# EAGLE schematic Arm_Board_2018 (EAGLE 8.2.2)

## Sheet 1 of 4: Tiva C + Misc
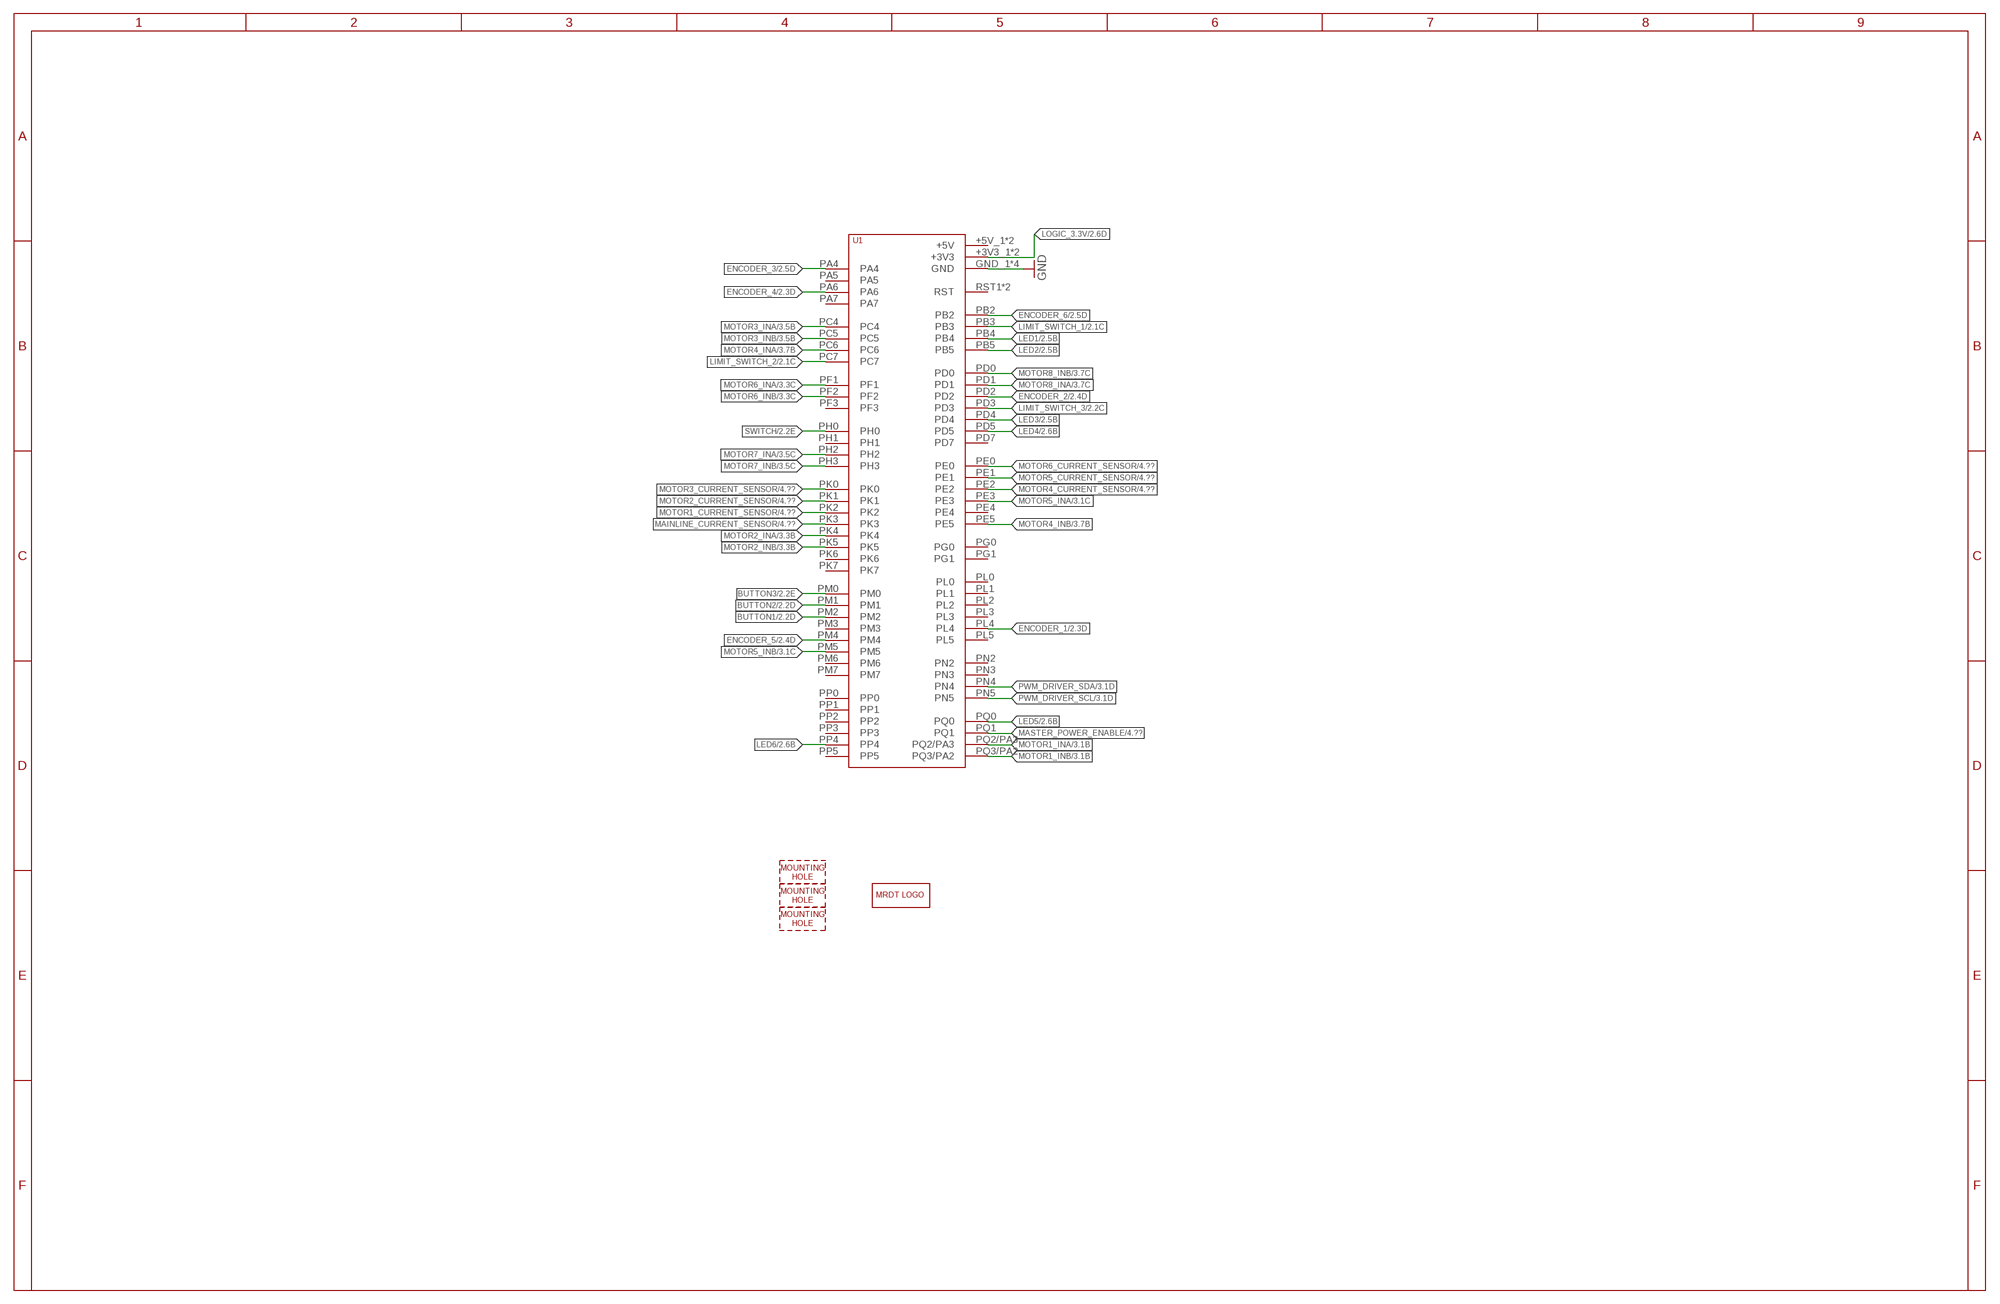
[diagram p0: schematic, sheet 1]

### Parts
H1  MOUNTING_HOLE#6  [#6_SCREW]
H2  MOUNTING_HOLE#6  [#6_SCREW]
H3  MOUNTING_HOLE#6  [#6_SCREW]
LOGO1  MRDT_LOGO  [MRDT_LOGO]
U1  TIVA-1294  [TIVA-C-CONNECTED]

### Nets
BUTTON1: U1.PM2 ; also sheet 2
BUTTON2: U1.PM1 ; also sheet 2
BUTTON3: U1.PM0 ; also sheet 2
ENCODER_1: U1.PL4 ; also sheet 2
ENCODER_2: U1.PD2 ; also sheet 2
ENCODER_3: U1.PA4 ; also sheet 2
ENCODER_4: U1.PA6 ; also sheet 2
ENCODER_5: U1.PM4 ; also sheet 2
ENCODER_6: U1.PB2 ; also sheet 2
GND: U1.GND_1(GND) U1.GND_2(GND) U1.GND_3(GND) U1.GND_4(GND) ; also sheet 2,3,4
LED1: U1.PB4 ; also sheet 2
LED2: U1.PB5 ; also sheet 2
LED3: U1.PD4 ; also sheet 2
LED4: U1.PD5 ; also sheet 2
LED5: U1.PQ0 ; also sheet 2
LED6: U1.PP4 ; also sheet 2
LIMIT_SWITCH_1: U1.PB3 ; also sheet 2
LIMIT_SWITCH_2: U1.PC7 ; also sheet 2
LIMIT_SWITCH_3: U1.PD3 ; also sheet 2
LOGIC_3.3V: U1.+3V3_1(+3V3) U1.+3V3_2(+3V3) ; also sheet 2,3,4
MAINLINE_CURRENT_SENSOR: U1.PK3 ; also sheet 4
MASTER_POWER_ENABLE: U1.PQ1 ; also sheet 4
MOTOR1_CURRENT_SENSOR: U1.PK2 ; also sheet 4
MOTOR1_INA: U1.PQ2/PA3 ; also sheet 3
MOTOR1_INB: U1.PQ3/PA2 ; also sheet 3
MOTOR2_CURRENT_SENSOR: U1.PK1 ; also sheet 4
MOTOR2_INA: U1.PK4 ; also sheet 3
MOTOR2_INB: U1.PK5 ; also sheet 3
MOTOR3_CURRENT_SENSOR: U1.PK0 ; also sheet 4
MOTOR3_INA: U1.PC4 ; also sheet 3
MOTOR3_INB: U1.PC5 ; also sheet 3
MOTOR4_CURRENT_SENSOR: U1.PE2 ; also sheet 4
MOTOR4_INA: U1.PC6 ; also sheet 3
MOTOR4_INB: U1.PE5 ; also sheet 3
MOTOR5_CURRENT_SENSOR: U1.PE1 ; also sheet 4
MOTOR5_INA: U1.PE3 ; also sheet 3
MOTOR5_INB: U1.PM5 ; also sheet 3
MOTOR6_CURRENT_SENSOR: U1.PE0 ; also sheet 4
MOTOR6_INA: U1.PF1 ; also sheet 3
MOTOR6_INB: U1.PF2 ; also sheet 3
MOTOR7_INA: U1.PH2 ; also sheet 3
MOTOR7_INB: U1.PH3 ; also sheet 3
MOTOR8_INA: U1.PD1 ; also sheet 3
MOTOR8_INB: U1.PD0 ; also sheet 3
PWM_DRIVER_SCL: U1.PN5 ; also sheet 3
PWM_DRIVER_SDA: U1.PN4 ; also sheet 3
SWITCH: U1.PH0 ; also sheet 2
Unconnected: U1.+5V_1(+5V) U1.+5V_2(+5V) U1.PA5 U1.PA7 U1.PD7 U1.PE4 U1.PF3 U1.PG0 U1.PG1 U1.PH1 U1.PK6 U1.PK7 U1.PL0 U1.PL1 U1.PL2 U1.PL3 U1.PL5 U1.PM3 U1.PM6 U1.PM7 U1.PN2 U1.PN3 U1.PP0 U1.PP1 U1.PP2 U1.PP3 U1.PP5 U1.RST1(RST) U1.RST_2(RST)

## Sheet 2 of 4: I/O
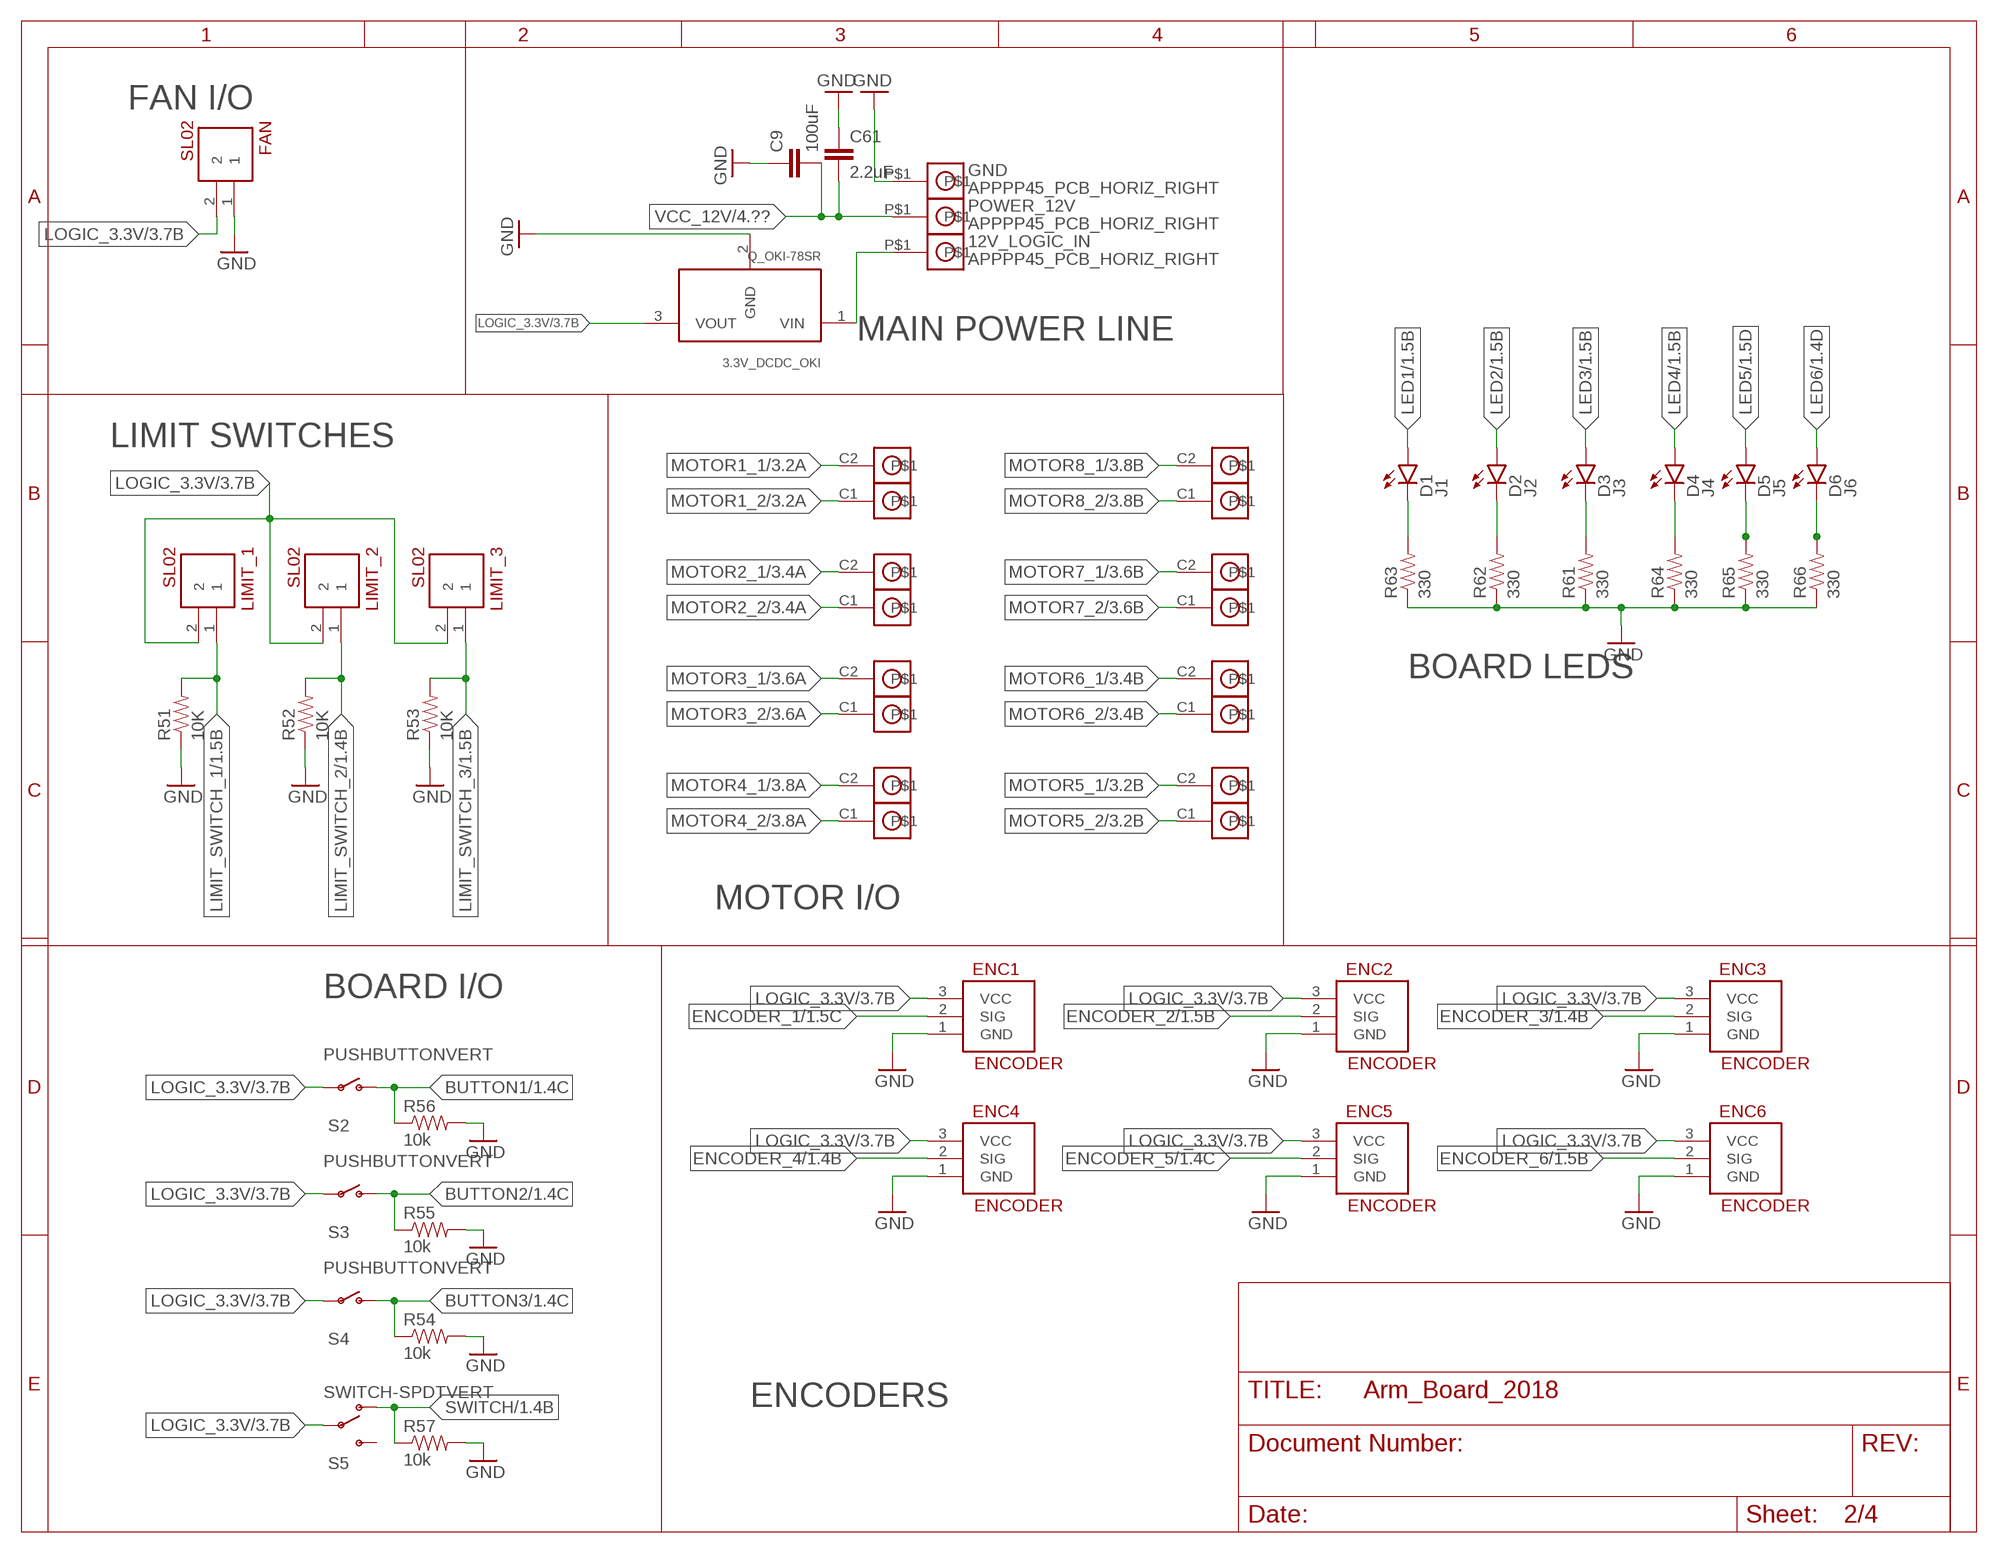
[diagram p1: schematic, sheet 2]

### Parts
3.3V_DCDC_OKI  Q_OKI-78SR  [Q_OKI-78SR]
12V_LOGIC_IN  APPPP45_PCB_HORIZ_RIGHT  [APP45_PCB_HORIZ_RIGHT]
C9  100uF  CAP1210  [1210]
C61  2.2uF  CAP1206  [1206]
D1  J1  LED0603  [LED-0603]
D2  J2  LED0603  [LED-0603]
D3  J3  LED0603  [LED-0603]
D4  J4  LED0603  [LED-0603]
D5  J5  LED0603  [LED-0603]
D6  J6  LED0603  [LED-0603]
ENC1  ENCODER  [MOLEX-70543-0002]
ENC2  ENCODER  [MOLEX-70543-0002]
ENC3  ENCODER  [MOLEX-70543-0002]
ENC4  ENCODER  [MOLEX-70543-0002]
ENC5  ENCODER  [MOLEX-70543-0002]
ENC6  ENCODER  [MOLEX-70543-0002]
FAN  SL02  [MOLEX-70543-0001]
GND  APPPP45_PCB_HORIZ_RIGHT  [APP45_PCB_HORIZ_RIGHT]
LIMIT_1  SL02  [MOLEX-70543-0001]
LIMIT_2  SL02  [MOLEX-70543-0001]
LIMIT_3  SL02  [MOLEX-70543-0001]
MOTOR1  APP_2POS_CONFIGGENERAL_CONFIG  [APP45_HORIZ_CONFIG]
MOTOR2  APP_2POS_CONFIGGENERAL_CONFIG  [APP45_HORIZ_CONFIG]
MOTOR3  APP_2POS_CONFIGGENERAL_CONFIG  [APP45_HORIZ_CONFIG]
MOTOR4  APP_2POS_CONFIGGENERAL_CONFIG  [APP45_HORIZ_CONFIG]
MOTOR5  APP_2POS_CONFIGGENERAL_CONFIG  [APP45_HORIZ_CONFIG]
MOTOR6  APP_2POS_CONFIGGENERAL_CONFIG  [APP45_HORIZ_CONFIG]
MOTOR7  APP_2POS_CONFIGGENERAL_CONFIG  [APP45_HORIZ_CONFIG]
MOTOR8  APP_2POS_CONFIGGENERAL_CONFIG  [APP45_HORIZ_CONFIG]
POWER_12V  APPPP45_PCB_HORIZ_RIGHT  [APP45_PCB_HORIZ_RIGHT]
R51  10K  RESISTOR0402-RES  [0402-RES]
R52  10K  RESISTOR0402-RES  [0402-RES]
R53  10K  RESISTOR0402-RES  [0402-RES]
R54  10k  RESISTOR0402-RES  [0402-RES]
R55  10k  RESISTOR0402-RES  [0402-RES]
R56  10k  RESISTOR0402-RES  [0402-RES]
R57  10k  RESISTOR0402-RES  [0402-RES]
R61  330  RESISTOR0402-RES  [0402-RES]
R62  330  RESISTOR0402-RES  [0402-RES]
R63  330  RESISTOR0402-RES  [0402-RES]
R64  330  RESISTOR0402-RES  [0402-RES]
R65  330  RESISTOR0402-RES  [0402-RES]
R66  330  RESISTOR0402-RES  [0402-RES]
S2  PUSHBUTTONVERT  [APEM-MJTP1243]
S3  PUSHBUTTONVERT  [APEM-MJTP1243]
S4  PUSHBUTTONVERT  [APEM-MJTP1243]
S5  SWITCH-SPDTVERT  [C&K-SS12D07VG4NSGAPA]

### Nets
BUTTON1: R56.1 S2.P$2(S) ; also sheet 1
BUTTON2: R55.1 S3.P$2(S) ; also sheet 1
BUTTON3: R54.1 S4.P$2(S) ; also sheet 1
ENCODER_1: ENC1.2(SIG) ; also sheet 1
ENCODER_2: ENC2.2(SIG) ; also sheet 1
ENCODER_3: ENC3.2(SIG) ; also sheet 1
ENCODER_4: ENC4.2(SIG) ; also sheet 1
ENCODER_5: ENC5.2(SIG) ; also sheet 1
ENCODER_6: ENC6.2(SIG) ; also sheet 1
GND: 3.3V_DCDC_OKI.2(GND) C9.1 C61.1 ENC1.1(GND) ENC2.1(GND) ENC3.1(GND) ENC4.1(GND) ENC5.1(GND) ENC6.1(GND) FAN.1 GND.P$1 R51.1 R52.1 R53.1 R54.2 R55.2 R56.2 R57.2 R61.1 R62.1 R63.1 R64.1 R65.1 R66.1 ; also sheet 1,3,4
LED1: D1.A ; also sheet 1
LED2: D2.A ; also sheet 1
LED3: D3.A ; also sheet 1
LED4: D4.A ; also sheet 1
LED5: D5.A ; also sheet 1
LED6: D6.A ; also sheet 1
LIMIT_SWITCH_1: LIMIT_1.1 R51.2 ; also sheet 1
LIMIT_SWITCH_2: LIMIT_2.1 R52.2 ; also sheet 1
LIMIT_SWITCH_3: LIMIT_3.1 R53.2 ; also sheet 1
LOGIC_3.3V: 3.3V_DCDC_OKI.3(VOUT) ENC1.3(VCC) ENC2.3(VCC) ENC3.3(VCC) ENC4.3(VCC) ENC5.3(VCC) ENC6.3(VCC) FAN.2 LIMIT_1.2 LIMIT_2.2 LIMIT_3.2 S2.P$1(P) S3.P$1(P) S4.P$1(P) S5.P$2(P) ; also sheet 1,3,4
MOTOR1_1 [Power Trace]: MOTOR1.C2 ; also sheet 3
MOTOR1_2 [Power Trace]: MOTOR1.C1 ; also sheet 3
MOTOR2_1 [Power Trace]: MOTOR2.C2 ; also sheet 3
MOTOR2_2 [Power Trace]: MOTOR2.C1 ; also sheet 3
MOTOR3_1 [Power Trace]: MOTOR3.C2 ; also sheet 3
MOTOR3_2 [Power Trace]: MOTOR3.C1 ; also sheet 3
MOTOR4_1: MOTOR4.C2 ; also sheet 3
MOTOR4_2 [Power Trace]: MOTOR4.C1 ; also sheet 3
MOTOR5_1 [Power Trace]: MOTOR5.C2 ; also sheet 3
MOTOR5_2 [Power Trace]: MOTOR5.C1 ; also sheet 3
MOTOR6_1 [Power Trace]: MOTOR6.C2 ; also sheet 3
MOTOR6_2 [Power Trace]: MOTOR6.C1 ; also sheet 3
MOTOR7_1 [Power Trace]: MOTOR7.C2 ; also sheet 3
MOTOR7_2 [Power Trace]: MOTOR7.C1 ; also sheet 3
MOTOR8_1 [Power Trace]: MOTOR8.C2 ; also sheet 3
MOTOR8_2 [Power Trace]: MOTOR8.C1 ; also sheet 3
N$8: 3.3V_DCDC_OKI.1(VIN) 12V_LOGIC_IN.P$1
N$68: D1.C R63.2
N$69: D2.C R62.2
N$77: D6.C R66.2
N$79: D3.C R61.2
N$80: D4.C R64.2
N$81: D5.C R65.2
SWITCH: R57.1 S5.P$3(O) ; also sheet 1
VCC_12V: C9.2 C61.2 POWER_12V.P$1 ; also sheet 4
Unconnected: S5.P$1(S)

### Notes on the sheet
- FAN I/O
- MAIN POWER LINE
- LIMIT SWITCHES
- BOARD LEDS
- MOTOR I/O
- BOARD I/O
- ENCODERS

## Sheet 3 of 4: H-Bridges
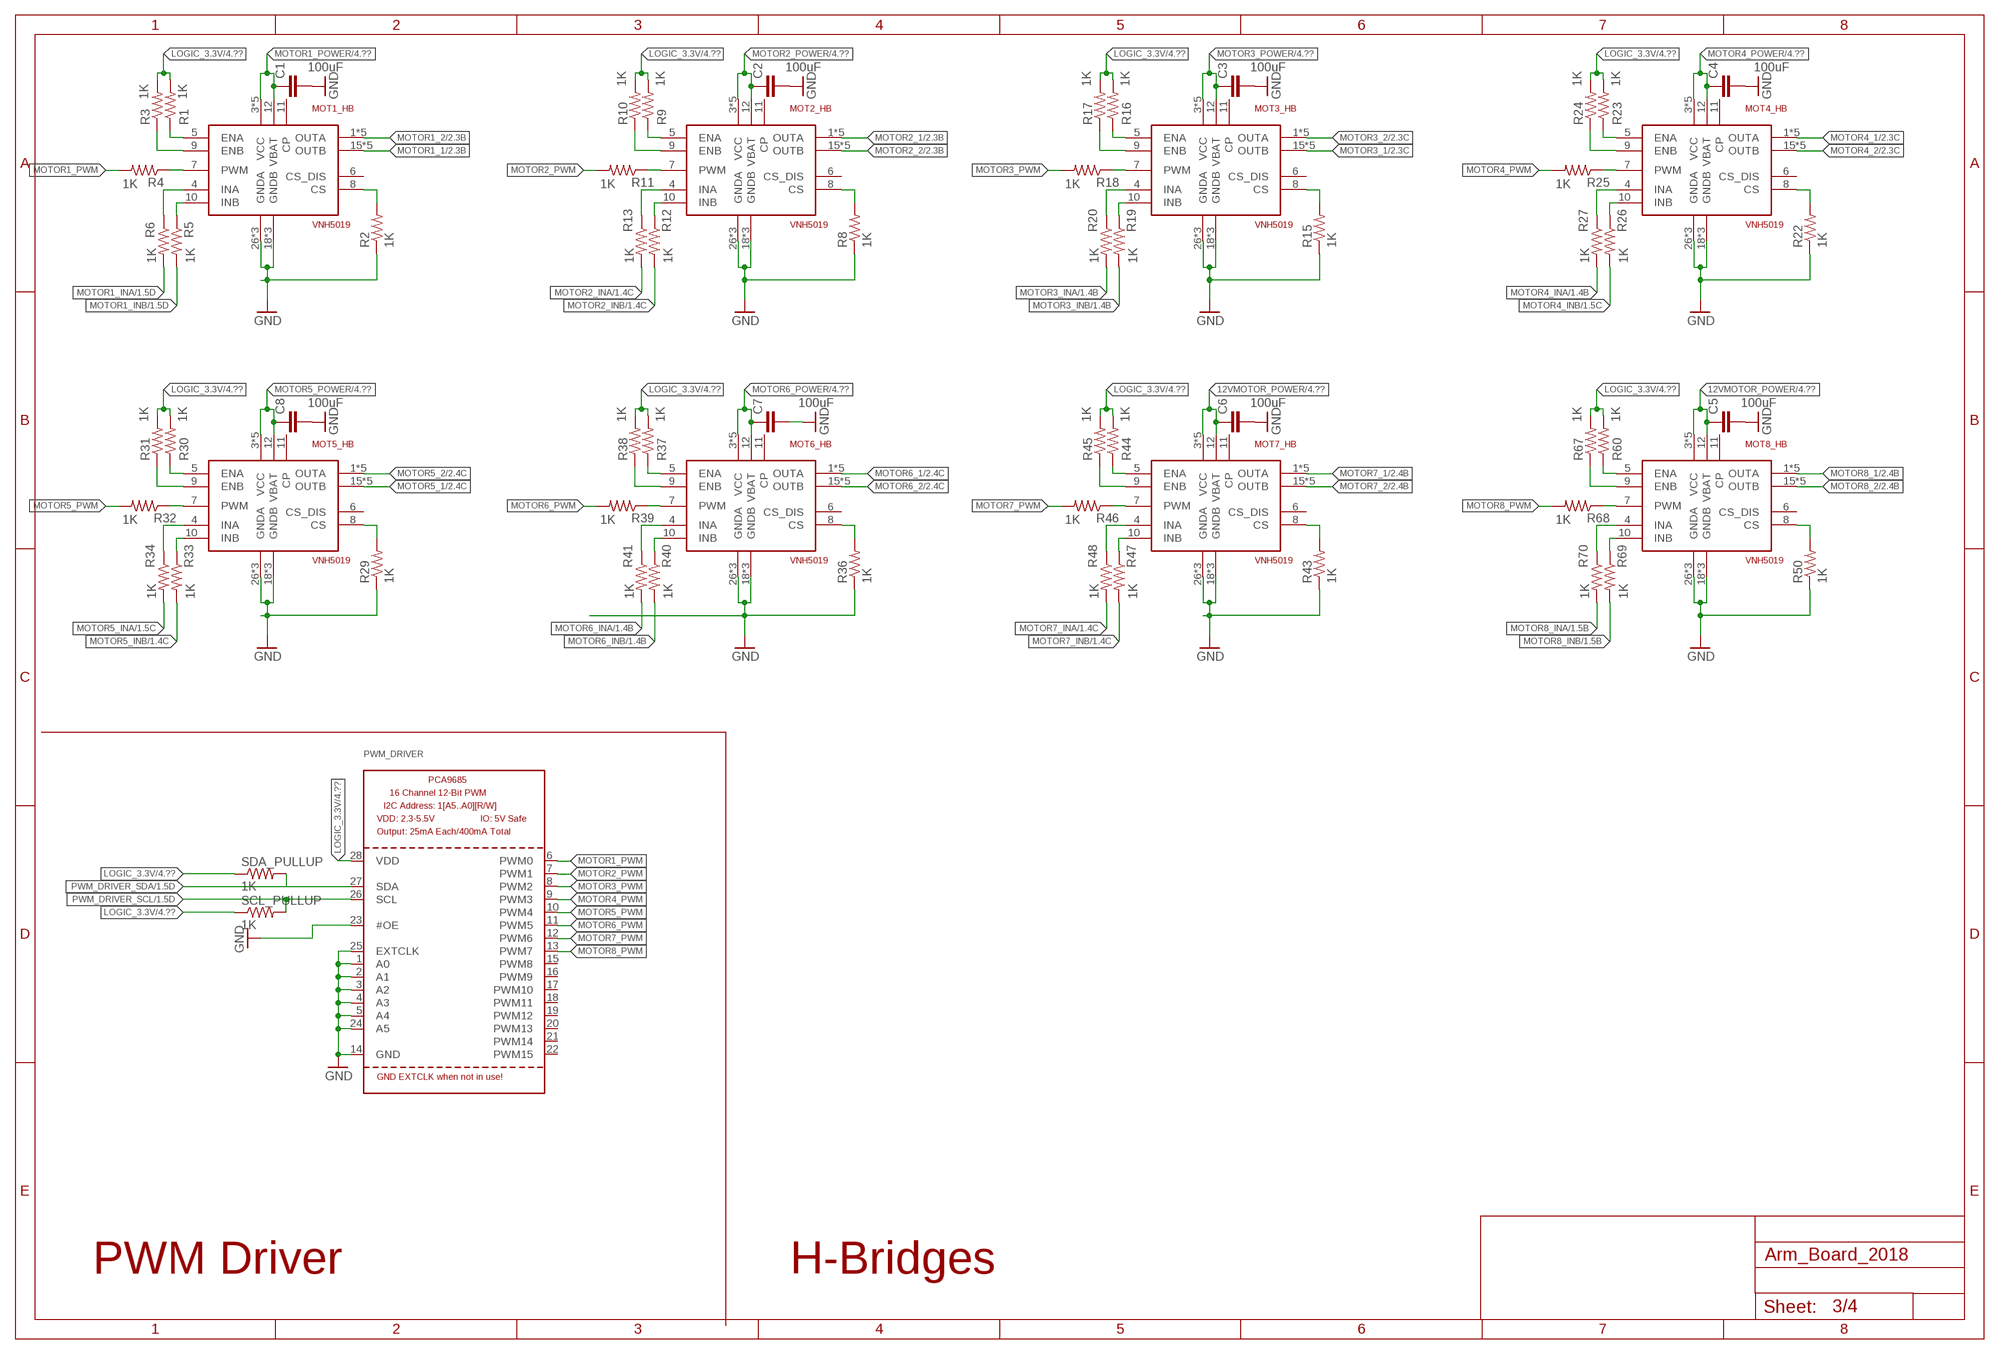
[diagram p2: schematic, sheet 3]

### Parts
C1  100uF  CAP1210  [1210]
C2  100uF  CAP1210  [1210]
C3  100uF  CAP1210  [1210]
C4  100uF  CAP1210  [1210]
C5  100uF  CAP1210  [1210]
C6  100uF  CAP1210  [1210]
C7  100uF  CAP1210  [1210]
C8  100uF  CAP1210  [1210]
MOT1_HB  VNH5019  [MULTIPOWERSO-30]
MOT2_HB  VNH5019  [MULTIPOWERSO-30]
MOT3_HB  VNH5019  [MULTIPOWERSO-30]
MOT4_HB  VNH5019  [MULTIPOWERSO-30]
MOT5_HB  VNH5019  [MULTIPOWERSO-30]
MOT6_HB  VNH5019  [MULTIPOWERSO-30]
MOT7_HB  VNH5019  [MULTIPOWERSO-30]
MOT8_HB  VNH5019  [MULTIPOWERSO-30]
PWM_DRIVER  PCA9685  [TSSOP28]
R1  1K  RESISTOR0603-RES  [0603-RES]
R2  1K  RESISTOR0603-RES  [0603-RES]
R3  1K  RESISTOR0603-RES  [0603-RES]
R4  1K  RESISTOR0603-RES  [0603-RES]
R5  1K  RESISTOR0603-RES  [0603-RES]
R6  1K  RESISTOR0603-RES  [0603-RES]
R8  1K  RESISTOR0603-RES  [0603-RES]
R9  1K  RESISTOR0603-RES  [0603-RES]
R10  1K  RESISTOR0603-RES  [0603-RES]
R11  1K  RESISTOR0603-RES  [0603-RES]
R12  1K  RESISTOR0603-RES  [0603-RES]
R13  1K  RESISTOR0603-RES  [0603-RES]
R15  1K  RESISTOR0603-RES  [0603-RES]
R16  1K  RESISTOR0603-RES  [0603-RES]
R17  1K  RESISTOR0603-RES  [0603-RES]
R18  1K  RESISTOR0603-RES  [0603-RES]
R19  1K  RESISTOR0603-RES  [0603-RES]
R20  1K  RESISTOR0603-RES  [0603-RES]
R22  1K  RESISTOR0603-RES  [0603-RES]
R23  1K  RESISTOR0603-RES  [0603-RES]
R24  1K  RESISTOR0603-RES  [0603-RES]
R25  1K  RESISTOR0603-RES  [0603-RES]
R26  1K  RESISTOR0603-RES  [0603-RES]
R27  1K  RESISTOR0603-RES  [0603-RES]
R29  1K  RESISTOR0603-RES  [0603-RES]
R30  1K  RESISTOR0603-RES  [0603-RES]
R31  1K  RESISTOR0603-RES  [0603-RES]
R32  1K  RESISTOR0603-RES  [0603-RES]
R33  1K  RESISTOR0603-RES  [0603-RES]
R34  1K  RESISTOR0603-RES  [0603-RES]
R36  1K  RESISTOR0603-RES  [0603-RES]
R37  1K  RESISTOR0603-RES  [0603-RES]
R38  1K  RESISTOR0603-RES  [0603-RES]
R39  1K  RESISTOR0603-RES  [0603-RES]
R40  1K  RESISTOR0603-RES  [0603-RES]
R41  1K  RESISTOR0603-RES  [0603-RES]
R43  1K  RESISTOR0603-RES  [0603-RES]
R44  1K  RESISTOR0603-RES  [0603-RES]
R45  1K  RESISTOR0603-RES  [0603-RES]
R46  1K  RESISTOR0603-RES  [0603-RES]
R47  1K  RESISTOR0603-RES  [0603-RES]
R48  1K  RESISTOR0603-RES  [0603-RES]
R50  1K  RESISTOR0603-RES  [0603-RES]
R60  1K  RESISTOR0603-RES  [0603-RES]
R67  1K  RESISTOR0603-RES  [0603-RES]
R68  1K  RESISTOR0603-RES  [0603-RES]
R69  1K  RESISTOR0603-RES  [0603-RES]
R70  1K  RESISTOR0603-RES  [0603-RES]
SCL_PULLUP  1K  RESISTOR0402-RES  [0402-RES]
SDA_PULLUP  1K  RESISTOR0402-RES  [0402-RES]

### Nets
12VMOTOR_POWER [Power Trace]: C5.1 C6.1 MOT7_HB.3(VCC) MOT7_HB.12(VBAT) MOT7_HB.13(VCC) MOT7_HB.23(VCC) MOT7_HB.VCC MOT7_HB.VCC@1(VCC) MOT8_HB.3(VCC) MOT8_HB.12(VBAT) MOT8_HB.13(VCC) MOT8_HB.23(VCC) MOT8_HB.VCC MOT8_HB.VCC@1(VCC) ; also sheet 4
GND: C1.2 C2.2 C3.2 C4.2 C5.2 C6.2 C7.2 C8.2 MOT1_HB.18(GNDB) MOT1_HB.19(GNDB) MOT1_HB.20(GNDB) MOT1_HB.26(GNDA) MOT1_HB.27(GNDA) MOT1_HB.28(GNDA) MOT2_HB.18(GNDB) MOT2_HB.19(GNDB) MOT2_HB.20(GNDB) MOT2_HB.26(GNDA) MOT2_HB.27(GNDA) MOT2_HB.28(GNDA) MOT3_HB.18(GNDB) MOT3_HB.19(GNDB) MOT3_HB.20(GNDB) MOT3_HB.26(GNDA) MOT3_HB.27(GNDA) MOT3_HB.28(GNDA) MOT4_HB.18(GNDB) MOT4_HB.19(GNDB) MOT4_HB.20(GNDB) MOT4_HB.26(GNDA) MOT4_HB.27(GNDA) MOT4_HB.28(GNDA) MOT5_HB.18(GNDB) MOT5_HB.19(GNDB) MOT5_HB.20(GNDB) MOT5_HB.26(GNDA) MOT5_HB.27(GNDA) MOT5_HB.28(GNDA) MOT6_HB.18(GNDB) MOT6_HB.19(GNDB) MOT6_HB.20(GNDB) MOT6_HB.26(GNDA) MOT6_HB.27(GNDA) MOT6_HB.28(GNDA) MOT7_HB.18(GNDB) MOT7_HB.19(GNDB) MOT7_HB.20(GNDB) MOT7_HB.26(GNDA) MOT7_HB.27(GNDA) MOT7_HB.28(GNDA) MOT8_HB.18(GNDB) MOT8_HB.19(GNDB) MOT8_HB.20(GNDB) MOT8_HB.26(GNDA) MOT8_HB.27(GNDA) MOT8_HB.28(GNDA) PWM_DRIVER.1(A0) PWM_DRIVER.2(A1) PWM_DRIVER.3(A2) PWM_DRIVER.4(A3) PWM_DRIVER.5(A4) PWM_DRIVER.14(GND) PWM_DRIVER.23(#OE) PWM_DRIVER.24(A5) PWM_DRIVER.25(EXTCLK) R2.1 R8.1 R15.1 R22.1 R29.1 R36.1 R43.1 R50.1 ; also sheet 1,2,4
LOGIC_3.3V: PWM_DRIVER.28(VDD) R1.2 R3.2 R9.2 R10.2 R16.2 R17.2 R23.2 R24.2 R30.2 R31.2 R37.2 R38.2 R44.2 R45.2 R60.2 R67.2 SCL_PULLUP.1 SDA_PULLUP.1 ; also sheet 1,2,4
MOTOR1_1 [Power Trace]: MOT1_HB.15(OUTB) MOT1_HB.16(OUTB) MOT1_HB.21(OUTB) MOT1_HB.OUTB MOT1_HB.OUTB@1(OUTB) ; also sheet 2
MOTOR1_2 [Power Trace]: MOT1_HB.1(OUTA) MOT1_HB.25(OUTA) MOT1_HB.30(OUTA) MOT1_HB.OUTA MOT1_HB.OUTA@1(OUTA) ; also sheet 2
MOTOR1_INA: R6.2 ; also sheet 1
MOTOR1_INB: R5.2 ; also sheet 1
MOTOR1_POWER [Power Trace]: C1.1 MOT1_HB.3(VCC) MOT1_HB.12(VBAT) MOT1_HB.13(VCC) MOT1_HB.23(VCC) MOT1_HB.VCC MOT1_HB.VCC@1(VCC) ; also sheet 4
MOTOR1_PWM: PWM_DRIVER.6(PWM0) R4.2
MOTOR2_1 [Power Trace]: MOT2_HB.1(OUTA) MOT2_HB.25(OUTA) MOT2_HB.30(OUTA) MOT2_HB.OUTA MOT2_HB.OUTA@1(OUTA) ; also sheet 2
MOTOR2_2 [Power Trace]: MOT2_HB.15(OUTB) MOT2_HB.16(OUTB) MOT2_HB.21(OUTB) MOT2_HB.OUTB MOT2_HB.OUTB@1(OUTB) ; also sheet 2
MOTOR2_INA: R13.2 ; also sheet 1
MOTOR2_INB: R12.2 ; also sheet 1
MOTOR2_POWER [Power Trace]: C2.1 MOT2_HB.3(VCC) MOT2_HB.12(VBAT) MOT2_HB.13(VCC) MOT2_HB.23(VCC) MOT2_HB.VCC MOT2_HB.VCC@1(VCC) ; also sheet 4
MOTOR2_PWM: PWM_DRIVER.7(PWM1) R11.2
MOTOR3_1 [Power Trace]: MOT3_HB.15(OUTB) MOT3_HB.16(OUTB) MOT3_HB.21(OUTB) MOT3_HB.OUTB MOT3_HB.OUTB@1(OUTB) ; also sheet 2
MOTOR3_2 [Power Trace]: MOT3_HB.1(OUTA) MOT3_HB.25(OUTA) MOT3_HB.30(OUTA) MOT3_HB.OUTA MOT3_HB.OUTA@1(OUTA) ; also sheet 2
MOTOR3_INA: R20.2 ; also sheet 1
MOTOR3_INB: R19.2 ; also sheet 1
MOTOR3_POWER [Power Trace]: C3.1 MOT3_HB.3(VCC) MOT3_HB.12(VBAT) MOT3_HB.13(VCC) MOT3_HB.23(VCC) MOT3_HB.VCC MOT3_HB.VCC@1(VCC) ; also sheet 4
MOTOR3_PWM: PWM_DRIVER.8(PWM2) R18.2
MOTOR4_1: MOT4_HB.1(OUTA) MOT4_HB.25(OUTA) MOT4_HB.30(OUTA) MOT4_HB.OUTA MOT4_HB.OUTA@1(OUTA) ; also sheet 2
MOTOR4_2 [Power Trace]: MOT4_HB.15(OUTB) MOT4_HB.16(OUTB) MOT4_HB.21(OUTB) MOT4_HB.OUTB MOT4_HB.OUTB@1(OUTB) ; also sheet 2
MOTOR4_INA: R27.2 ; also sheet 1
MOTOR4_INB: R26.2 ; also sheet 1
MOTOR4_POWER [Power Trace]: C4.1 MOT4_HB.3(VCC) MOT4_HB.12(VBAT) MOT4_HB.13(VCC) MOT4_HB.23(VCC) MOT4_HB.VCC MOT4_HB.VCC@1(VCC) ; also sheet 4
MOTOR4_PWM: PWM_DRIVER.9(PWM3) R25.2
MOTOR5_1 [Power Trace]: MOT5_HB.15(OUTB) MOT5_HB.16(OUTB) MOT5_HB.21(OUTB) MOT5_HB.OUTB MOT5_HB.OUTB@1(OUTB) ; also sheet 2
MOTOR5_2 [Power Trace]: MOT5_HB.1(OUTA) MOT5_HB.25(OUTA) MOT5_HB.30(OUTA) MOT5_HB.OUTA MOT5_HB.OUTA@1(OUTA) ; also sheet 2
MOTOR5_INA: R34.2 ; also sheet 1
MOTOR5_INB: R33.2 ; also sheet 1
MOTOR5_POWER [Power Trace]: C8.1 MOT5_HB.3(VCC) MOT5_HB.12(VBAT) MOT5_HB.13(VCC) MOT5_HB.23(VCC) MOT5_HB.VCC MOT5_HB.VCC@1(VCC) ; also sheet 4
MOTOR5_PWM: PWM_DRIVER.10(PWM4) R32.2
MOTOR6_1 [Power Trace]: MOT6_HB.1(OUTA) MOT6_HB.25(OUTA) MOT6_HB.30(OUTA) MOT6_HB.OUTA MOT6_HB.OUTA@1(OUTA) ; also sheet 2
MOTOR6_2 [Power Trace]: MOT6_HB.15(OUTB) MOT6_HB.16(OUTB) MOT6_HB.21(OUTB) MOT6_HB.OUTB MOT6_HB.OUTB@1(OUTB) ; also sheet 2
MOTOR6_INA: R41.2 ; also sheet 1
MOTOR6_INB: R40.2 ; also sheet 1
MOTOR6_POWER [Power Trace]: C7.1 MOT6_HB.3(VCC) MOT6_HB.12(VBAT) MOT6_HB.13(VCC) MOT6_HB.23(VCC) MOT6_HB.VCC MOT6_HB.VCC@1(VCC) ; also sheet 4
MOTOR6_PWM: PWM_DRIVER.11(PWM5) R39.2
MOTOR7_1 [Power Trace]: MOT7_HB.1(OUTA) MOT7_HB.25(OUTA) MOT7_HB.30(OUTA) MOT7_HB.OUTA MOT7_HB.OUTA@1(OUTA) ; also sheet 2
MOTOR7_2 [Power Trace]: MOT7_HB.15(OUTB) MOT7_HB.16(OUTB) MOT7_HB.21(OUTB) MOT7_HB.OUTB MOT7_HB.OUTB@1(OUTB) ; also sheet 2
MOTOR7_INA: R48.2 ; also sheet 1
MOTOR7_INB: R47.2 ; also sheet 1
MOTOR7_PWM: PWM_DRIVER.12(PWM6) R46.2
MOTOR8_1 [Power Trace]: MOT8_HB.1(OUTA) MOT8_HB.25(OUTA) MOT8_HB.30(OUTA) MOT8_HB.OUTA MOT8_HB.OUTA@1(OUTA) ; also sheet 2
MOTOR8_2 [Power Trace]: MOT8_HB.15(OUTB) MOT8_HB.16(OUTB) MOT8_HB.21(OUTB) MOT8_HB.OUTB MOT8_HB.OUTB@1(OUTB) ; also sheet 2
MOTOR8_INA: R70.2 ; also sheet 1
MOTOR8_INB: R69.2 ; also sheet 1
MOTOR8_PWM: PWM_DRIVER.13(PWM7) R68.2
N$5: MOT2_HB.8(CS) R8.2
N$6: MOT1_HB.8(CS) R2.2
N$10: MOT1_HB.5(ENA) R1.1
N$14: MOT1_HB.9(ENB) R3.1
N$16: MOT1_HB.7(PWM) R4.1
N$18: MOT1_HB.10(INB) R5.1
N$20: MOT1_HB.4(INA) R6.1
N$21: MOT2_HB.5(ENA) R9.1
N$22: MOT2_HB.9(ENB) R10.1
N$23: MOT2_HB.7(PWM) R11.1
N$24: MOT2_HB.10(INB) R12.1
N$25: MOT2_HB.4(INA) R13.1
N$27: MOT3_HB.8(CS) R15.2
N$28: MOT3_HB.5(ENA) R16.1
N$29: MOT3_HB.9(ENB) R17.1
N$30: MOT3_HB.7(PWM) R18.1
N$31: MOT3_HB.10(INB) R19.1
N$32: MOT3_HB.4(INA) R20.1
N$33: MOT4_HB.8(CS) R22.2
N$34: MOT4_HB.5(ENA) R23.1
N$35: MOT4_HB.9(ENB) R24.1
N$36: MOT4_HB.7(PWM) R25.1
N$37: MOT4_HB.10(INB) R26.1
N$38: MOT4_HB.4(INA) R27.1
N$39: MOT5_HB.8(CS) R29.2
N$40: MOT5_HB.5(ENA) R30.1
N$41: MOT5_HB.9(ENB) R31.1
N$42: MOT5_HB.7(PWM) R32.1
N$43: MOT5_HB.10(INB) R33.1
N$44: MOT5_HB.4(INA) R34.1
N$46: MOT6_HB.8(CS) R36.2
N$47: MOT6_HB.5(ENA) R37.1
N$49: MOT6_HB.9(ENB) R38.1
N$50: MOT6_HB.7(PWM) R39.1
N$51: MOT6_HB.10(INB) R40.1
N$52: MOT6_HB.4(INA) R41.1
N$53: MOT7_HB.8(CS) R43.2
N$54: MOT7_HB.5(ENA) R44.1
N$55: MOT7_HB.9(ENB) R45.1
N$56: MOT7_HB.7(PWM) R46.1
N$57: MOT7_HB.10(INB) R47.1
N$58: MOT7_HB.4(INA) R48.1
N$59: MOT8_HB.8(CS) R50.2
N$60: MOT8_HB.5(ENA) R60.1
N$61: MOT8_HB.9(ENB) R67.1
N$62: MOT8_HB.7(PWM) R68.1
N$63: MOT8_HB.10(INB) R69.1
N$64: MOT8_HB.4(INA) R70.1
PWM_DRIVER_SCL: PWM_DRIVER.26(SCL) SCL_PULLUP.2 ; also sheet 1
PWM_DRIVER_SDA: PWM_DRIVER.27(SDA) SDA_PULLUP.2 ; also sheet 1
Unconnected: MOT1_HB.6(CS_DIS) MOT1_HB.11(CP) MOT2_HB.6(CS_DIS) MOT2_HB.11(CP) MOT3_HB.6(CS_DIS) MOT3_HB.11(CP) MOT4_HB.6(CS_DIS) MOT4_HB.11(CP) MOT5_HB.6(CS_DIS) MOT5_HB.11(CP) MOT6_HB.6(CS_DIS) MOT6_HB.11(CP) MOT7_HB.6(CS_DIS) MOT7_HB.11(CP) MOT8_HB.6(CS_DIS) MOT8_HB.11(CP) PWM_DRIVER.15(PWM8) PWM_DRIVER.16(PWM9) PWM_DRIVER.17(PWM10) PWM_DRIVER.18(PWM11) PWM_DRIVER.19(PWM12) PWM_DRIVER.20(PWM13) PWM_DRIVER.21(PWM14) PWM_DRIVER.22(PWM15)

### Notes on the sheet
- PWM Driver | H-Bridges

## Sheet 4 of 4: Power
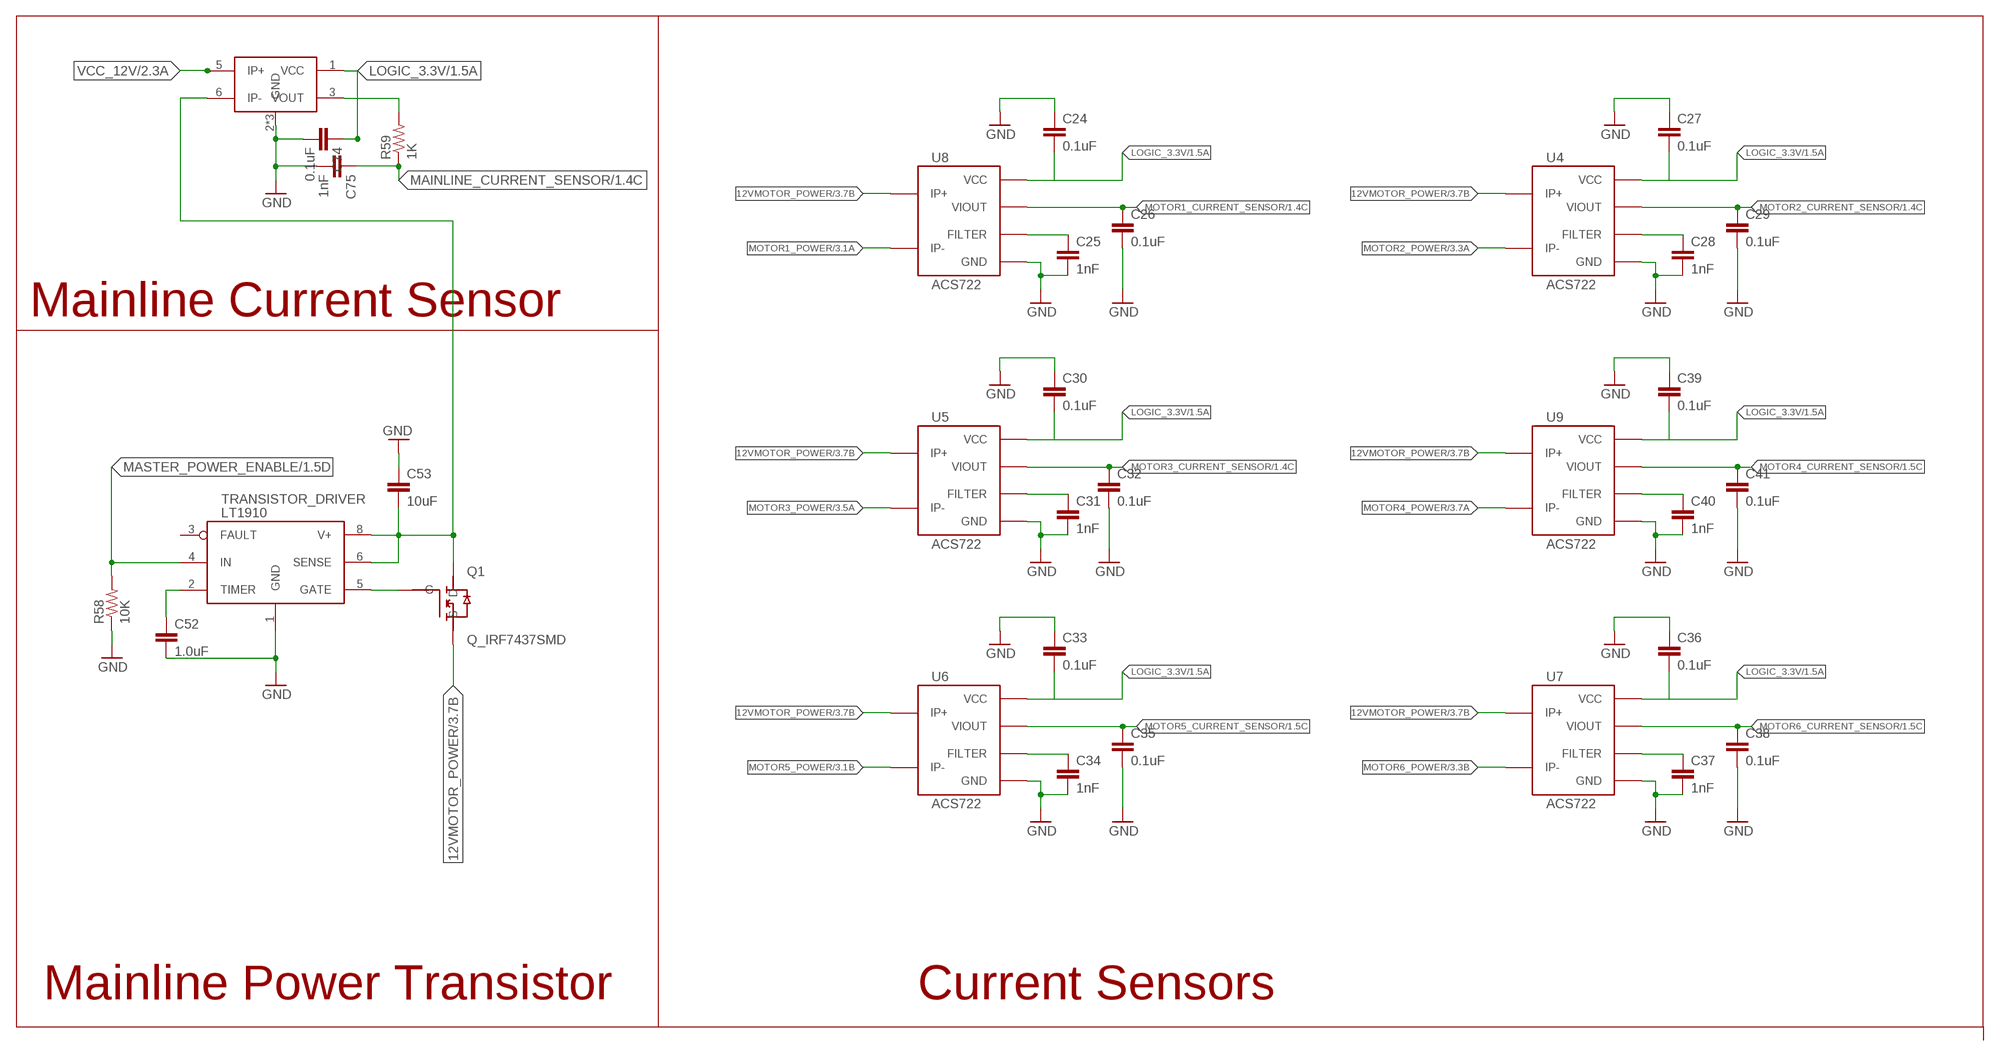
[diagram p3: schematic, sheet 4]

### Parts
C24  0.1uF  CAP0603-CAP  [0603-CAP]
C25  1nF  CAP0603-CAP  [0603-CAP]
C26  0.1uF  CAP0603-CAP  [0603-CAP]
C27  0.1uF  CAP0603-CAP  [0603-CAP]
C28  1nF  CAP0603-CAP  [0603-CAP]
C29  0.1uF  CAP0603-CAP  [0603-CAP]
C30  0.1uF  CAP0603-CAP  [0603-CAP]
C31  1nF  CAP0603-CAP  [0603-CAP]
C32  0.1uF  CAP0603-CAP  [0603-CAP]
C33  0.1uF  CAP0603-CAP  [0603-CAP]
C34  1nF  CAP0603-CAP  [0603-CAP]
C35  0.1uF  CAP0603-CAP  [0603-CAP]
C36  0.1uF  CAP0603-CAP  [0603-CAP]
C37  1nF  CAP0603-CAP  [0603-CAP]
C38  0.1uF  CAP0603-CAP  [0603-CAP]
C39  0.1uF  CAP0603-CAP  [0603-CAP]
C40  1nF  CAP0603-CAP  [0603-CAP]
C41  0.1uF  CAP0603-CAP  [0603-CAP]
C52  1.0uF  CAP0603-CAP  [0603-CAP]
C53  10uF  CAP0603-CAP  [0603-CAP]
C74  0.1uF  CAP0603-CAP  [0603-CAP]
C75  1nF  CAP0603-CAP  [0603-CAP]
MAINLINE_CURRENT  ACS781  [7-POWER_SMD_MODULE]
Q1  Q_IRF7437SMD  [D2PACK]
R58  10K  RESISTOR0402-RES  [0402-RES]
R59  1K  RESISTOR0402-RES  [0402-RES]
TRANSISTOR_DRIVER  LT1910  [SO8]
U4  ACS722  [SOIC8]
U5  ACS722  [SOIC8]
U6  ACS722  [SOIC8]
U7  ACS722  [SOIC8]
U8  ACS722  [SOIC8]
U9  ACS722  [SOIC8]

### Nets
12VMOTOR_POWER [Power Trace]: Q1.2(S) U4.1(IP+) U4.2(IP+) U5.1(IP+) U5.2(IP+) U6.1(IP+) U6.2(IP+) U7.1(IP+) U7.2(IP+) U8.1(IP+) U8.2(IP+) U9.1(IP+) U9.2(IP+) ; also sheet 3
GND: C24.1 C25.2 C26.2 C27.1 C28.2 C29.2 C30.1 C31.2 C32.2 C33.1 C34.2 C35.2 C36.1 C37.2 C38.2 C39.1 C40.2 C41.2 C52.2 C53.1 C74.2 C75.2 MAINLINE_CURRENT.2(GND) MAINLINE_CURRENT.4(GND) MAINLINE_CURRENT.7(GND) R58.1 TRANSISTOR_DRIVER.1(GND) U4.5(GND) U5.5(GND) U6.5(GND) U7.5(GND) U8.5(GND) U9.5(GND) ; also sheet 1,2,3
LOGIC_3.3V: C24.2 C27.2 C30.2 C33.2 C36.2 C39.2 C74.1 MAINLINE_CURRENT.1(VCC) U4.8(VCC) U5.8(VCC) U6.8(VCC) U7.8(VCC) U8.8(VCC) U9.8(VCC) ; also sheet 1,2,3
MAINLINE_CURRENT_SENSOR: C75.1 R59.1 ; also sheet 1
MASTER_POWER_ENABLE: R58.2 TRANSISTOR_DRIVER.4(IN) ; also sheet 1
MOTOR1_CURRENT_SENSOR: C26.1 U8.7(VIOUT) ; also sheet 1
MOTOR1_POWER [Power Trace]: U8.3(IP-) U8.4(IP-) ; also sheet 3
MOTOR2_CURRENT_SENSOR: C29.1 U4.7(VIOUT) ; also sheet 1
MOTOR2_POWER [Power Trace]: U4.3(IP-) U4.4(IP-) ; also sheet 3
MOTOR3_CURRENT_SENSOR: C32.1 U5.7(VIOUT) ; also sheet 1
MOTOR3_POWER [Power Trace]: U5.3(IP-) U5.4(IP-) ; also sheet 3
MOTOR4_CURRENT_SENSOR: C41.1 U9.7(VIOUT) ; also sheet 1
MOTOR4_POWER [Power Trace]: U9.3(IP-) U9.4(IP-) ; also sheet 3
MOTOR5_CURRENT_SENSOR: C35.1 U6.7(VIOUT) ; also sheet 1
MOTOR5_POWER [Power Trace]: U6.3(IP-) U6.4(IP-) ; also sheet 3
MOTOR6_CURRENT_SENSOR: C38.1 U7.7(VIOUT) ; also sheet 1
MOTOR6_POWER [Power Trace]: U7.3(IP-) U7.4(IP-) ; also sheet 3
N$7: C28.1 U4.6(FILTER)
N$9: C52.1 TRANSISTOR_DRIVER.2(TIMER)
N$11: C25.1 U8.6(FILTER)
N$12: C31.1 U5.6(FILTER)
N$15: C34.1 U6.6(FILTER)
N$17: C37.1 U7.6(FILTER)
N$19: C40.1 U9.6(FILTER)
N$45: Q1.1(G) TRANSISTOR_DRIVER.5(GATE)
N$48: C53.2 MAINLINE_CURRENT.6(IP-) Q1.TAB(D) TRANSISTOR_DRIVER.6(SENSE) TRANSISTOR_DRIVER.8(V+)
N$100: MAINLINE_CURRENT.3(VOUT) R59.2
VCC_12V: MAINLINE_CURRENT.5(IP+) ; also sheet 2
Unconnected: TRANSISTOR_DRIVER.3(FAULT)

### Notes on the sheet
- Mainline Current Sensor
- Mainline Power Transistor | Current Sensors

## Library data of the parts
3.3V_DCDC_OKI = MRDT-2014-All:Q_OKI-78SR: Fixed Output 1-5 AMP SIP DC/DC converter(can be 5V or 3.3V)
12V_LOGIC_IN GND POWER_12V = MRDT-Connectors:APP: http://www.powerwerx.com/anderson-powerpoles/
C1-C9 = SparkFun-Capacitors:CAP: Capacitor Standard 0603 ceramic capacitor, and 0.1" leaded capacitor.
C24-C41 C52 C53 C61 C74 C75 = SparkFun-Passives:CAP: Capacitor Standard 0603 ceramic capacitor, and 0.1" leaded capacitor.
D1-D6 = MRDT-EAGLE-Training:LED: LEDs Standard schematic elements and footprints for 5mm, 3mm, 1206, and 0603 sized LEDs. 5mm - Spark Fun Electronics SKU : COM-00529 (and others)
ENC1-ENC6 = MRDT-Connectors:ENCODER
FAN LIMIT_1-LIMIT_3 = MRDT-Connectors:SL02
H1-H3 = MRDT-Hardware:MOUNTING_HOLE: Mounting hole for M6 bolt. Standard use mounting hole for: Tiva C Connected - M6 Anderson Powerpole Mounting Wing - M8 Most frame-mounted PCB's - M8
LOGO1 = MRDT-Hardware:MRDT_LOGO
MAINLINE_CURRENT = MRDT-ICs:ACS781: ACS781 Current Sensor
MOT1_HB MOT2_HB MOT3_HB MOT4_HB MOT5_HB MOT6_HB MOT7_HB MOT8_HB = MRDT-ICs:VNH5019: H bridge, High current, CMOS or TTL compatible.; CURR_CONT_LIM: 12A; CURR_MAX_LIM: 30A; VCC: 5.5-24V
MOTOR1-MOTOR8 = MRDT-Connectors:APP_2POS_CONFIG
PWM_DRIVER = adafruit:PCA9685: PCA9685 - 16 Channel 12-Bit I2C PWM Controller 5.0V tolerant 16 channel, 12-bit I2C PWM controller with 25mA per output (max. 400mA total) Digikey: 568-5931-1-ND
Q1 = MRDT-2015-PowerBoard:Q_IRF*7437: 40V 195A N-CH MOSFET switch with heatsink
R1-R6 R8-R13 R15-R20 R22-R27 R29-R34 R36-R41 R43-R48 R50 R60 R67-R70 = SparkFun-Resistors:RESISTOR: Resistor Basic schematic elements and footprints for 0603, 1206, and PTH resistors.
R51-R59 R61-R66 SCL_PULLUP SDA_PULLUP = SparkFun-Passives:RESISTOR: Resistor Basic schematic elements and footprints for 0603, 1206, and PTH resistors.
S2-S4 = MRDT-UserInput:PUSHBUTTON; PARTNO: MJTP1243
S5 = MRDT-UserInput:SWITCH-SPDT; PARTNO: SS12D07VG4NSGAPA
TRANSISTOR_DRIVER = MRDT-2015-PowerBoard:LT1910
U1 = MRDT-Microcontrollers:TIVA-1294: TIVA C CONNECTED LAUNCHPAD
U4-U9 = MRDT-ICs:ACS722; PARTNO: ACS722

## Net classes
2 Ethernet: width 0.22 mm, clearance 0.152 mm
3 Power Trace: width 1.829 mm, clearance 0.406 mm